# EAGLE schematic schematic_thermoelectric_driver (EAGLE 9.3.0)
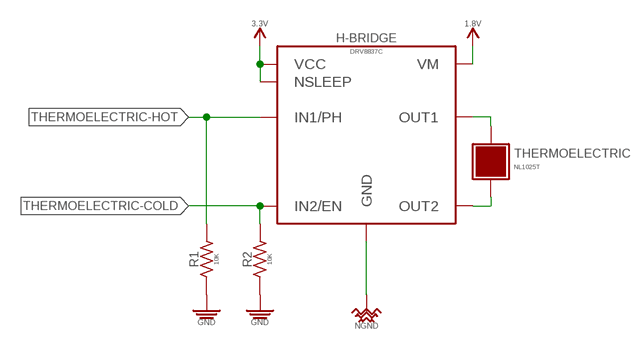
[diagram p0: schematic, sheet 1]

## Parts
H-BRIDGE  DRV8837C  DRV883X_H-BRIDGE_DRV8837C_1A  [WSON-8-PPAD]
R1  10K  10KΩ_SMD-0402_1/16W-5%  [RESC1005X35_SMD-0402]
R2  10K  10KΩ_SMD-0402_1/16W-5%  [RESC1005X35_SMD-0402]
THERMOELECTRIC  NL1025T  PELTIER-TEC_CONNECTOR_0530470210_VERT-MALE_PITCH-1.25MM  [_MOLEX-0530470210_VERT_PITCH-1.25MM]

## Nets
1.8V: H-BRIDGE.1(VM)
3.3V [vcc]: H-BRIDGE.7(NSLEEP) H-BRIDGE.8(VCC)
GND [DGND]: R1.1 R2.1
N$1: H-BRIDGE.3(OUT2) THERMOELECTRIC.2(COLD)
N$5: H-BRIDGE.2(OUT1) THERMOELECTRIC.1(HOT)
NGND [NGND]: H-BRIDGE.4(GND) H-BRIDGE.GND H-BRIDGE.P$1(GND) H-BRIDGE.P$2(GND)
THERMOELECTRIC-COLD: H-BRIDGE.5(IN2/EN) R2.2
THERMOELECTRIC-HOT: H-BRIDGE.6(IN1/PH) R1.2

## Library data of the parts
H-BRIDGE = _special:DRV883X_H-BRIDGE: DRV883x Series H-Bridge - DRV8837 -> PWM (IN1 & IN2); DRV8838 -> PH IN1/ENA IN2; DATASHEET: http://www.ti.com/lit/ds/symlink/drv8837c.pdf; DIST: Digikey; DISTLINK: https://www.digikey.com/products/en?keywords=296-44747-1-ND; DISTPN: 296-44747-1-ND; MFR: Texas Instruments; MPN: DRV8837CDSGT; VALUE: DRV8837C 1A
R1 R2 = _resistors:10KΩ; DATASHEET: http://www.yageo.com/NewPortal/yageodocoutput?fileName=/pdf/R-Chip/PYu-RC_51_RoHS_P_0.pdf; DIST: Digikey; DISTLINK: https://www.digikey.com/products/en?keywords=YAG1281CT-ND; DISTPN: YAG1281CT-ND; MFR: Yageo; MPN: RC0402JR-0710KP
THERMOELECTRIC = _actuators:PELTIER-TEC_CONNECTOR; DATASHEET: https://cdn2.hubspot.net/hubfs/547732/Data_Sheets/NL1025T.pdf; DATASHEET_CONNECTOR1: https://www.molex.com/pdm_docs/sd/530470210_sd.pdf; DATASHEET_CONNECTOR2: https://www.molex.com/pdm_docs/sd/510210700_sd.pdf; DATASHEET_CRIMP: https://www.molex.com/pdm_docs/sd/500798000_sd.pdf; DIST: Digikey; DISTLINK: https://www.digikey.com/products/en?keywords=1681-1032-ND; DISTLINK_CONNECTOR1: https://www.digikey.com/products/en?keywords=WM1731-ND; DISTLINK_CONNECTOR2: https://www.digikey.com/products/en?keywords=WM1720-ND; DISTLINK_CRIMP: https://www.digikey.com/products/en?keywords=WM1142CT-ND; DISTPN: 1681-1032-ND; DISTPN_CONNECTOR1: WM1731-ND; DISTPN_CONNECTOR2: WM1720-ND; DISTPN_CRIMP: WM1142CT-ND; DIST_CONNECTOR1: Digikey; DIST_CONNECTOR2: Digikey; DIST_CRIMP: Digikey; MFR: Marlow Industries, Inc.; MFR_CONNECTOR1: Molex, LLC; MFR_CONNECTOR2: Molex, LLC; MFR_CRIMP: Molex, LLC; MPN: NL1025T-01AC; MPN_CONNECTOR1: 0530470210; MPN_CONNECTOR2: 51021-0200; MPN_CRIMP: 0500798000; VALUE: PELTIER

## Module E
Ports: 

### Library data of the parts

## Net classes
1 vcc: width 0.254 mm, drill 0.254 mm, clearance 0.127 mm
4 DGND: width 0.254 mm
5 NGND: width 0.254 mm